# EAGLE schematic Edge_Con_Frame (EAGLE 7.2.0)
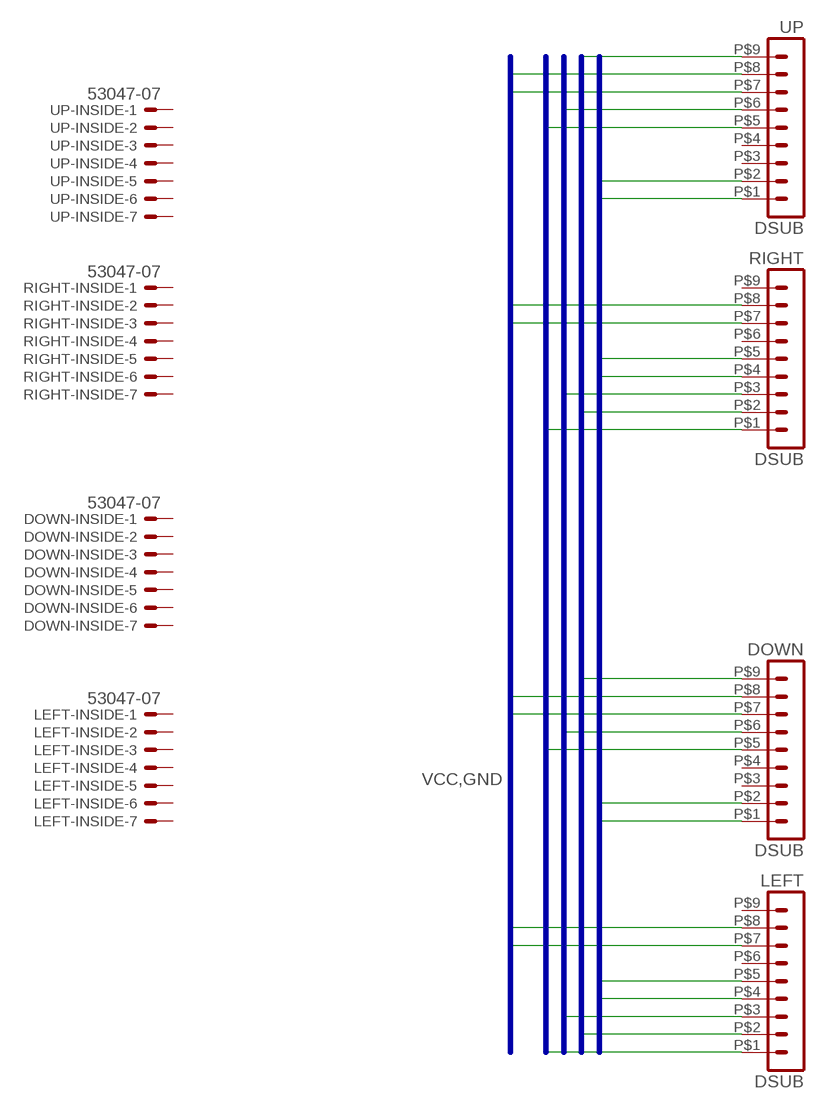
[diagram p0: schematic, sheet 1]

## Parts
DOWN  DSUB  [FOUR]
DOWN-INSIDE  53047-07  [53047-07]
LEFT  DSUB  [FOUR]
LEFT-INSIDE  53047-07  [53047-07]
RIGHT  DSUB  [FOUR]
RIGHT-INSIDE  53047-07  [53047-07]
UP  DSUB  [FOUR]
UP-INSIDE  53047-07  [53047-07]

## Nets
CLK_IN: DOWN.P$9 LEFT.P$2
CLK_OUT: RIGHT.P$2 UP.P$9
DOWN: DOWN.P$6
GND: DOWN.P$7 LEFT.P$7 RIGHT.P$7 UP.P$7
LEFT: LEFT.P$3
MDO: RIGHT.P$1 UP.P$5
RIGHT: RIGHT.P$3
SCL: DOWN.P$2 LEFT.P$5 RIGHT.P$5 UP.P$2
SDA: DOWN.P$1 LEFT.P$4 RIGHT.P$4 UP.P$1
SDI: DOWN.P$5 LEFT.P$1
UP: UP.P$6
VCC: DOWN.P$8 LEFT.P$8 RIGHT.P$8 UP.P$8
Unconnected: DOWN-INSIDE.1 DOWN-INSIDE.2 DOWN-INSIDE.3 DOWN-INSIDE.4 DOWN-INSIDE.5 DOWN-INSIDE.6 DOWN-INSIDE.7 DOWN.P$3 DOWN.P$4 LEFT-INSIDE.1 LEFT-INSIDE.2 LEFT-INSIDE.3 LEFT-INSIDE.4 LEFT-INSIDE.5 LEFT-INSIDE.6 LEFT-INSIDE.7 LEFT.P$6 LEFT.P$9 RIGHT-INSIDE.1 RIGHT-INSIDE.2 RIGHT-INSIDE.3 RIGHT-INSIDE.4 RIGHT-INSIDE.5 RIGHT-INSIDE.6 RIGHT-INSIDE.7 RIGHT.P$6 RIGHT.P$9 UP-INSIDE.1 UP-INSIDE.2 UP-INSIDE.3 UP-INSIDE.4 UP-INSIDE.5 UP-INSIDE.6 UP-INSIDE.7 UP.P$3 UP.P$4

## Buses
SDA,SCL
CLK_OUT,CLK_IN
UP,DOWN,LEFT,RIGHT
MDO,SDI
VCC,GND

## Library data of the parts
DOWN LEFT RIGHT UP = custom:DSUB: Side mount for DB9 connector.
DOWN-INSIDE LEFT-INSIDE RIGHT-INSIDE UP-INSIDE = con-molex:53?-07: CONNECTOR wire to board 1.25 mm (.049 inch) pitch header; MPN: 53047-0710-C; OC_FARNELL: 9732870; OC_NEWARK: 11M0149